# EasyEDA Pro project Chaoticvolt-4 digit 7seg display.eprj

# Schematic 4 digit 7seg display
Board Name: 4 digit 7seg display; Create Date: 2023-04-09; Page Name: display; Project Name: Chaoticvolt-4 digit 7seg display; Schematic Name: 4 digit 7seg display; Update Date: 2024-12-22; Company: Chaoticvolt; Drawed: Robin; Page Size: A4; Part Number: NTOCLOCKPCB-002; Reviewed: Robin; Version: V0.1
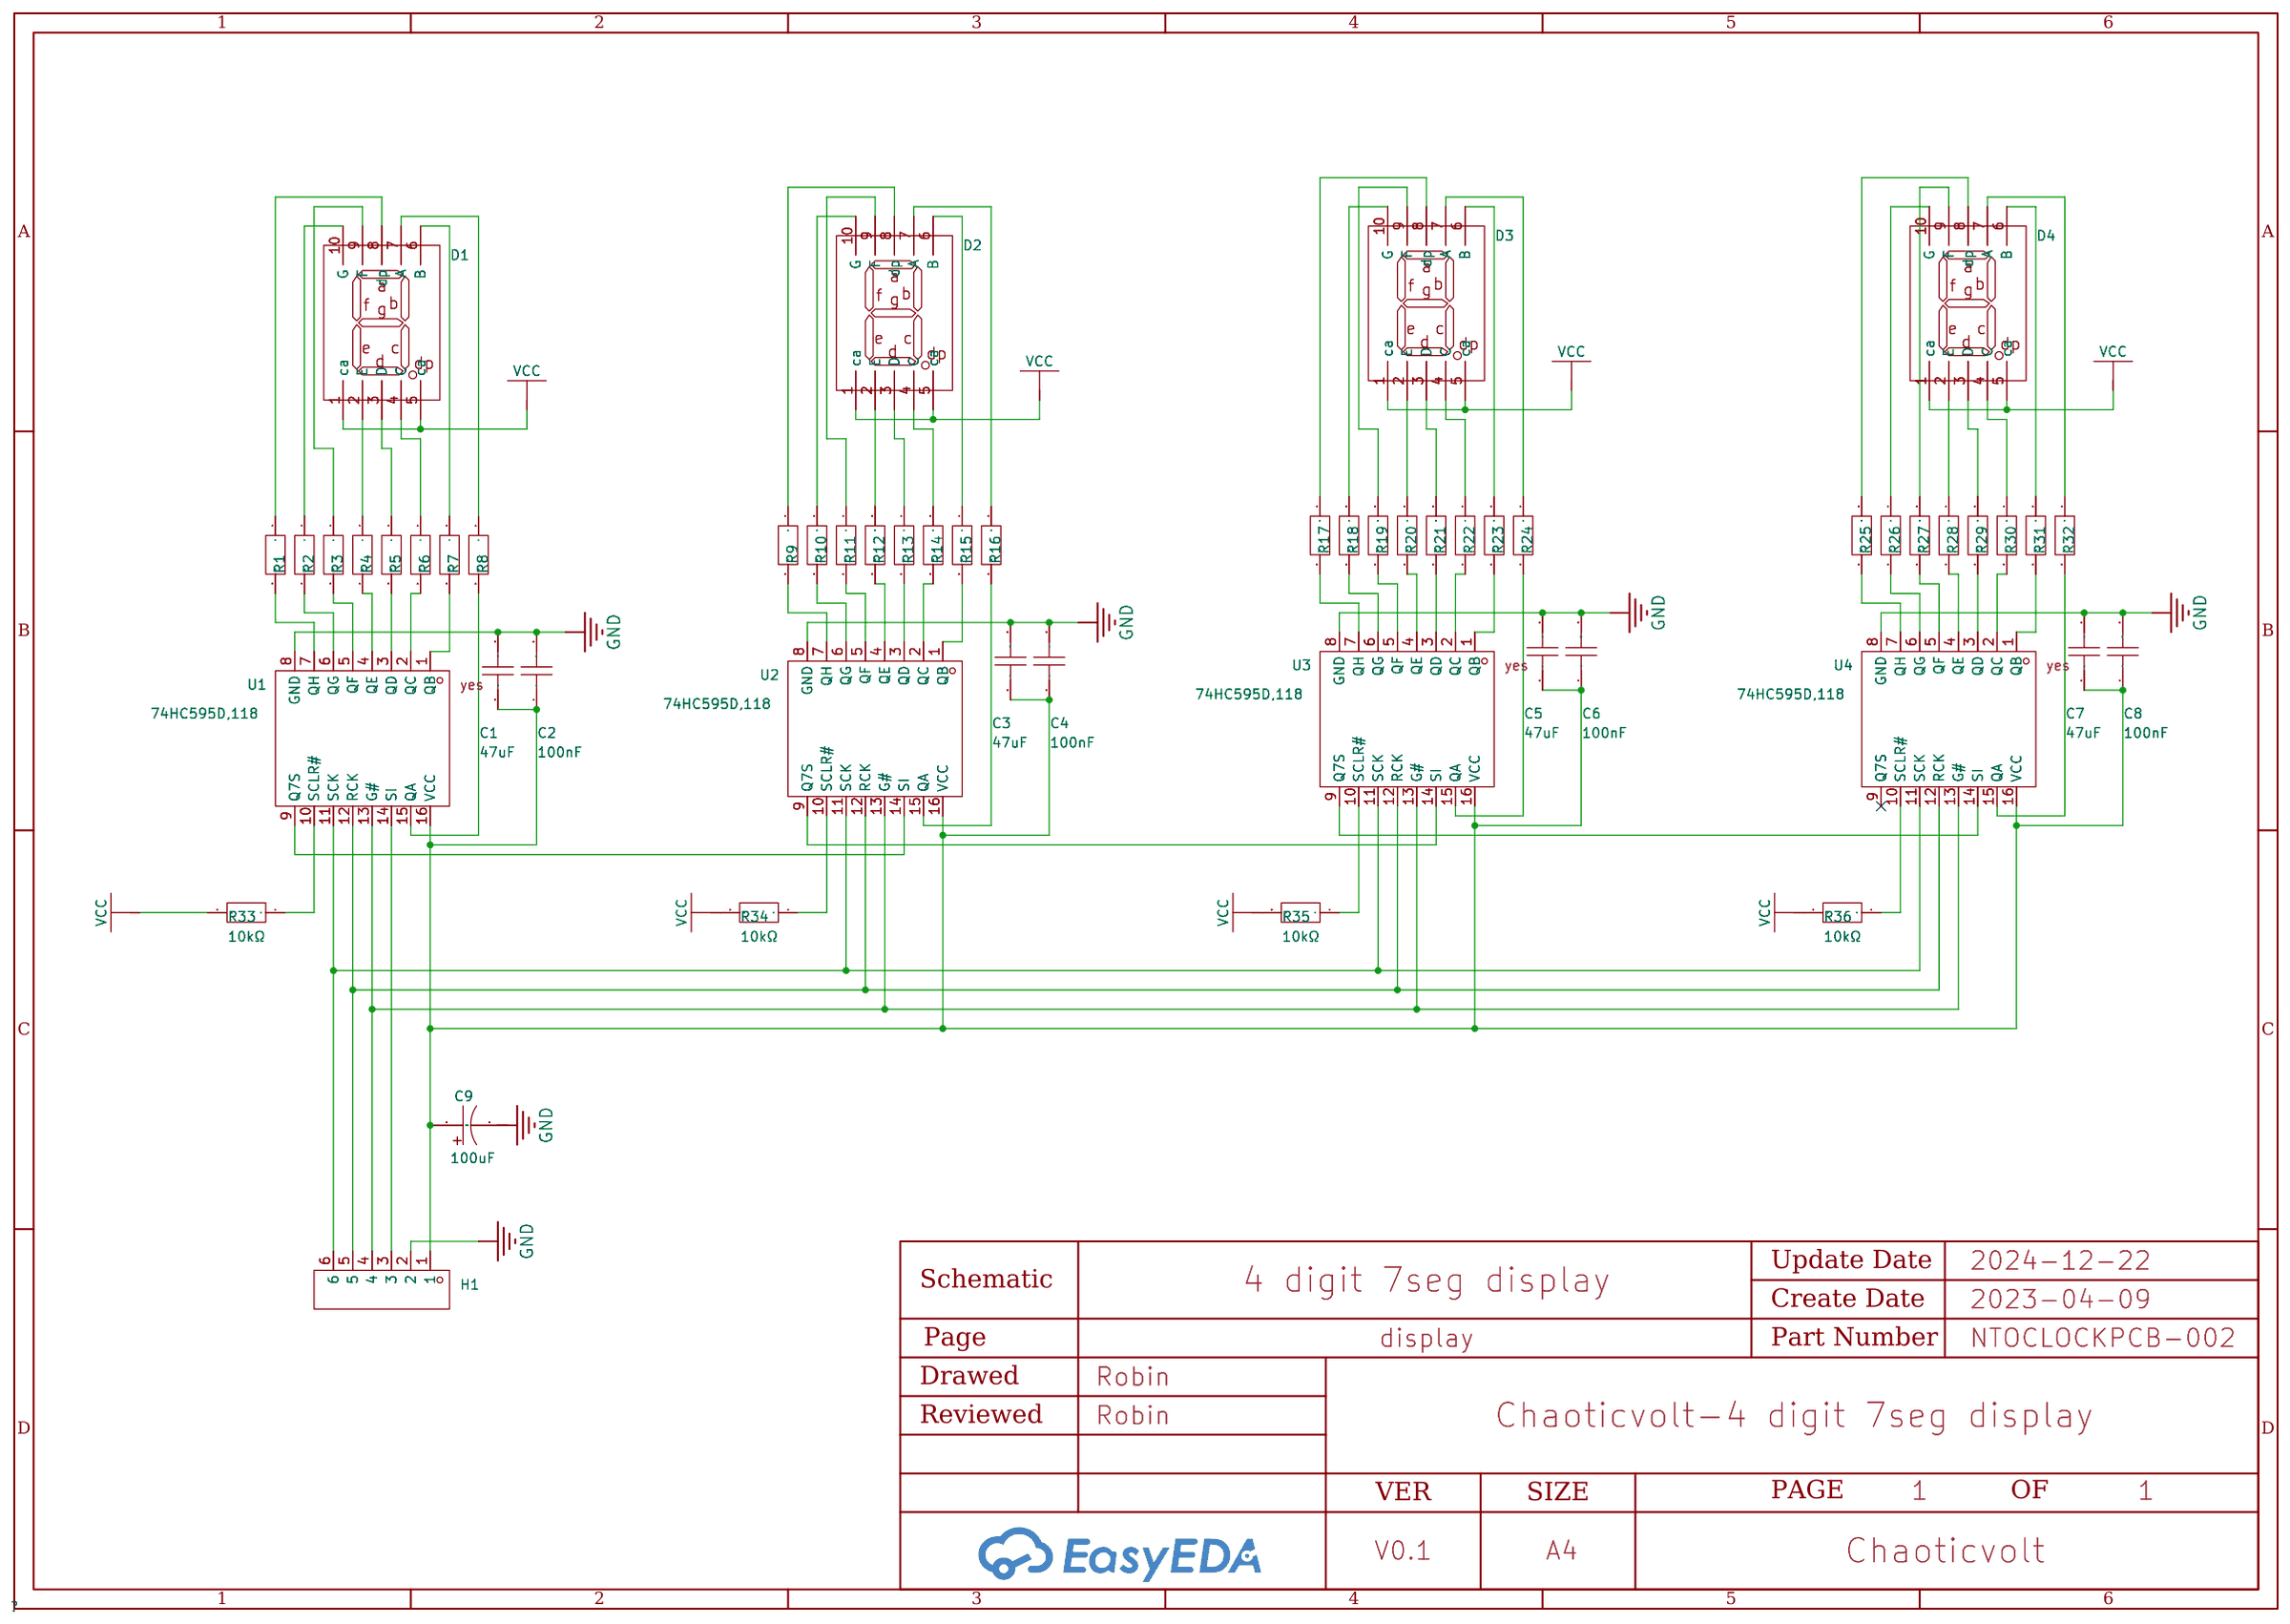
[diagram p0: schematic sheet]

## Parts
C1  47uF  [C1206]
C2  100nF  [C0402_NEW]
C3  47uF  [C1206]
C4  100nF  [C0402_NEW]
C5  47uF  [C1206]
C6  100nF  [C0402_NEW]
C7  47uF  [C1206]
C8  100nF  [C0402_NEW]
C9  100uF  [CAP-SMD_L3.5-W2.8-R-RD]
D1  -  [FJS12101]
D2  -  [FJS12101]
D3  -  [FJS12101]
D4  -  [FJS12101]
H1  -  [HDR-TH_6P-P2.54-V_Z-211-0611-0021-001]  (no BOM)
R1  100Ω  [R0805]
R2  100Ω  [R0805]
R3  100Ω  [R0805]
R4  100Ω  [R0805]
R5  100Ω  [R0805]
R6  100Ω  [R0805]
R7  100Ω  [R0805]
R8  100Ω  [R0805]
R9  100Ω  [R0805]
R10  100Ω  [R0805]
R11  100Ω  [R0805]
R12  100Ω  [R0805]
R13  100Ω  [R0805]
R14  100Ω  [R0805]
R15  100Ω  [R0805]
R16  100Ω  [R0805]
R17  100Ω  [R0805]
R18  100Ω  [R0805]
R19  100Ω  [R0805]
R20  100Ω  [R0805]
R21  100Ω  [R0805]
R22  100Ω  [R0805]
R23  100Ω  [R0805]
R24  100Ω  [R0805]
R25  100Ω  [R0805]
R26  100Ω  [R0805]
R27  100Ω  [R0805]
R28  100Ω  [R0805]
R29  100Ω  [R0805]
R30  100Ω  [R0805]
R31  100Ω  [R0805]
R32  100Ω  [R0805]
R33  10kΩ  [R0805]
R34  10kΩ  [R0805]
R35  10kΩ  [R0805]
R36  10kΩ  [R0805]
U1  74HC595D,118  [SOIC-16_L9.9-W3.9-P1.27-LS6.0-BL]
U2  74HC595D,118  [SOIC-16_L9.9-W3.9-P1.27-LS6.0-BL]
U3  74HC595D,118  [SOIC-16_L9.9-W3.9-P1.27-LS6.0-BL]
U4  74HC595D,118  [SOIC-16_L9.9-W3.9-P1.27-LS6.0-BL]

## Library data of the parts
C1 C3 C5 C7 = CL31A476MPHNNNE: Capacitance: Tolerance:±20% Tolerance:±20% Voltage Rated: Temperature Coefficient:; LCSC Part Name: 47uF ±20% 10V; Supplier Part: C96123; Manufacturer: SAMSUNG(三星); Supplier Footprint: 1206; JLCPCB Part Class: Basic Part; Datasheet: https://atta.szlcsc.com/upload/public/pdf/source/20170228/1488267692219.pdf; Supplier: LCSC; Tolerance: ±20%
C2 C4 C6 C8 = CL05B104KO5NNNC: Capacitance: Tolerance:±10% Tolerance:±10% Voltage Rated: Temperature Coefficient:; LCSC Part Name: 100nF ±10% 16V; Supplier Part: C1525; Manufacturer: SAMSUNG(三星); Supplier Footprint: 0402; JLCPCB Part Class: Basic Part; Datasheet: https://atta.szlcsc.com/upload/public/pdf/source/20160103/1457707674891.pdf; Supplier: LCSC; Tolerance: ±10%
C9 = CA45-B-10V-100uF-M: Capacitance: Tolerance:±20% Tolerance:±20% Rated Voltage: Equivalent Series Resistance(ESR):4Ω@100kHz Operating Temperature:-55℃~+125℃ Operating Temperature:-55℃~+125℃; LCSC Part Name: 100uF ±20% 10V; Supplier Part: C140381; Manufacturer: CEC(振华新云); Supplier Footprint: CASE-B-3528; JLCPCB Part Class: Extended Part; Datasheet: https://atta.szlcsc.com/upload/public/pdf/source/20171113/C140381_15105612817941115748.pdf; Supplier: LCSC; Tolerance: ±20%; Equivalent Series Resistance(ESR): 4Ω@100kHz; Operating Temperature: -55℃~+125℃
D1-D4 = FJS12101
H1 = PZ254R-11-06P: Pitch:2.54mm Number of Pins:6 Number of Rows: Pin Structure:1x6P Row Spacing:- Mounting Type:Shrouded Circluar Pins/Square Pins:Square Pins Current Rating (Max):- Voltage Rating (Max):- Length of Mating Pin:6mm Insulation Height:2.5mm Contact Material: Contact Plating:- Operating Temperature Range:-40~+105 Operating Temperature Range:-40~+105 Color:Black; LCSC Part Name: 2.54mm 1x6P 弯插 方针; Supplier Part: C492414; Manufacturer: XFCN(兴飞); Supplier Footprint: 弯插,P=2.54mm; JLCPCB Part Class: Extended Part; Datasheet: https://atta.szlcsc.com/upload/public/pdf/source/20200309/C492414_188252315A8FC19F8382BF484DD4F4B8.pdf; Supplier: LCSC; Pitch: 2.54mm; Number of Pins: 6; Pin Structure: 1x6P; Mounting Type: Shrouded; Circluar Pins/Square Pins: Square Pins; Length of Mating Pin: 6mm; Insulation Height: 2.5mm; Operating Temperature Range: -40~+105; Color: Black
R1-R32 = 0805W8F1000T5E_C17408: Type:Thick Film Resistors Resistance: Tolerance:±1% Tolerance:±1% Power(Watts): Temperature Coefficient:±100ppm/℃ Temperature Coefficient:±100ppm/℃ Overload Voltage (Max): Operating Temperature Range:-55℃~+155℃ Operating Temperature Range:-55℃~+155℃; LCSC Part Name: 100Ω ±1% 125mW; Supplier Part: C17408; Manufacturer: UNI-ROYAL(厚声); Manufacturer Part: 0805W8F1000T5E; Supplier Footprint: 0805; JLCPCB Part Class: Basic Part; Datasheet: https://atta.szlcsc.com/upload/public/pdf/source/20200306/C422600_1E6D84923E4A46A82E41ADD87F860B5C.pdf; Supplier: LCSC; Type: Thick Film Resistors; Tolerance: ±1%; Temperature Coefficient: ±100ppm/℃; Operating Temperature Range: -55℃~+155℃
R33-R36 = 0805W8F1002T5E: Type:Thick Film Resistors Resistance: Tolerance:±1% Tolerance:±1% Power(Watts): Temperature Coefficient:±100ppm/℃ Temperature Coefficient:±100ppm/℃ Overload Voltage (Max): Operating Temperature Range:-55℃~+155℃ Operating Temperature Range:-55℃~+155℃; LCSC Part Name: 10kΩ ±1% 125mW; Supplier Part: C17414; Manufacturer: UNI-ROYAL(厚声); Supplier Footprint: 0805; JLCPCB Part Class: Basic Part; Datasheet: https://atta.szlcsc.com/upload/public/pdf/source/20200306/C422600_1E6D84923E4A46A82E41ADD87F860B5C.pdf; Supplier: LCSC; Type: Thick Film Resistors; Tolerance: ±1%; Temperature Coefficient: ±100ppm/℃; Operating Temperature Range: -55℃~+155℃
U1-U4 = 74HC595D,118: Series: Logic Type:ShiftRegister Output Type:Tri-State Function:Serial to parallel, serial Voltage - Supply:2V~6V Voltage - Supply:2V~6V Operating Temperature:-40℃~+125℃ Operating Temperature:-40℃~+125℃; Supplier Part: C5947; Manufacturer: Nexperia(安世); Supplier Footprint: SOIC-16-150mil; JLCPCB Part Class: Basic Part; Datasheet: https://atta.szlcsc.com/upload/public/pdf/source/20140108/1457706668762.pdf; Supplier: LCSC; Logic Type: ShiftRegister; Output Type: Tri-State; Function: Serial to parallel, serial; Voltage - Supply: 2V~6V; Operating Temperature: -40℃~+125℃

## Nets
GND: C1.2 C2.2 C3.2 C4.2 C5.2 C6.2 C7.2 C8.2 C9.2 H1.2 U1.8(GND) U2.8(GND) U3.8(GND) U4.8(GND)
VCC: D1.1(ca) D1.5(ca) D2.1(ca) D2.5(ca) D3.1(ca) D3.5(ca) D4.1(ca) D4.5(ca) R33.2 R34.2 R35.2 R36.2
$1N2297: U1.9(Q7S) U2.14(SI)
$1N2299: R8.2 U1.15(QA)
$1N2301: R33.1 U1.10(SCLR#)
$1N2302: H1.4 U1.13(G#) U2.13(G#) U3.13(G#) U4.13(G#)
$1N2303: H1.5 U1.12(RCK) U2.12(RCK) U3.12(RCK) U4.12(RCK)
$1N2304: H1.3 U1.14(SI)
$1N2305: H1.6 U1.11(SCK) U2.11(SCK) U3.11(SCK) U4.11(SCK)
$1N6011: R7.2 U1.1(QB)
$1N6089: R3.2 U1.5(QF)
$1N6122: R6.2 U1.2(QC)
$1N6177: R5.2 U1.3(QD)
$1N6264: R4.2 U1.4(QE)
$1N6486: R2.2 U1.6(QG)
$1N6506: R1.2 U1.7(QH)
$1N40619: D1.7(A) R8.1
$1N40652: D1.6(B) R7.1
$1N40781: D1.9(F) R3.1
$1N41012: D1.10(G) R2.1
$1N41044: D1.8(dp) R1.1
$1N41338: D1.2(E) R4.1
$1N41427: D1.4(C) R6.1
$1N41428: D1.3(D) R5.1
$1N45593: R9.2 U2.7(QH)
$1N45594: R12.2 U2.4(QE)
$1N45595: R14.2 U2.2(QC)
$1N45596: R15.2 U2.1(QB)
$1N45597: R10.2 U2.6(QG)
$1N45598: R13.2 U2.3(QD)
$1N45599: R11.2 U2.5(QF)
$1N45600: R16.2 U2.15(QA)
$1N45601: D2.7(A) R16.1
$1N45602: D2.6(B) R15.1
$1N45603: D2.9(F) R11.1
$1N45604: D2.10(G) R10.1
$1N45605: D2.8(dp) R9.1
$1N45606: D2.4(C) R14.1
$1N45607: D2.3(D) R13.1
$1N45609: D2.2(E) R12.1
$1N46574: R17.2 U3.7(QH)
$1N46575: R20.2 U3.4(QE)
$1N46576: R22.2 U3.2(QC)
$1N46577: R23.2 U3.1(QB)
$1N46578: R18.2 U3.6(QG)
$1N46579: R21.2 U3.3(QD)
$1N46580: R19.2 U3.5(QF)
$1N46581: R24.2 U3.15(QA)
$1N46582: D3.7(A) R24.1
$1N46583: D3.6(B) R23.1
$1N46584: D3.9(F) R19.1
$1N46585: D3.10(G) R18.1
$1N46586: D3.8(dp) R17.1
$1N46587: D3.4(C) R22.1
$1N46588: D3.3(D) R21.1
$1N46590: D3.2(E) R20.1
$1N47559: R25.2 U4.7(QH)
$1N47560: R28.2 U4.4(QE)
$1N47561: R30.2 U4.2(QC)
$1N47562: R31.2 U4.1(QB)
$1N47563: R26.2 U4.6(QG)
$1N47564: R29.2 U4.3(QD)
$1N47565: R27.2 U4.5(QF)
$1N47566: R32.2 U4.15(QA)
$1N47567: D4.7(A) R32.1
$1N47568: D4.6(B) R31.1
$1N47569: D4.9(F) R27.1
$1N47570: D4.10(G) R26.1
$1N47571: D4.8(dp) R25.1
$1N47572: D4.4(C) R30.1
$1N47573: D4.3(D) R29.1
$1N47575: D4.2(E) R28.1
$1N47985: U2.9(Q7S) U3.14(SI)
$1N48013: U3.9(Q7S) U4.14(SI)
$1N52982: R34.1 U2.10(SCLR#)
$1N53020: R36.1 U4.10(SCLR#)
$1N56731: C1.1 C2.1 C3.1 C4.1 C5.1 C6.1 C7.1 C8.1 C9.1 H1.1 U1.16(VCC) U2.16(VCC) U3.16(VCC) U4.16(VCC)
$1N57025: R35.1 U3.10(SCLR#)

Not connected (* = marked no-connect by the designer): U4 9(Q7S)*

# Board display
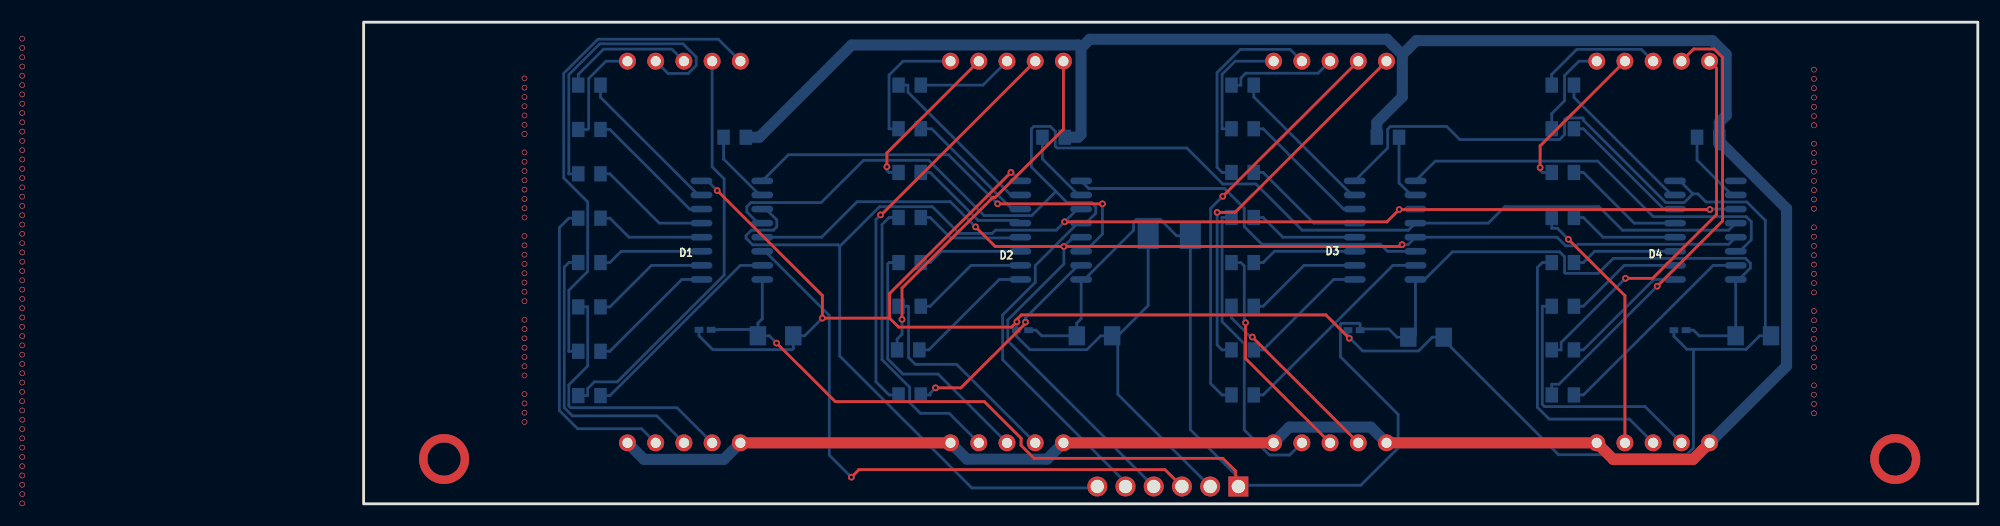
[diagram p1: board, top side]
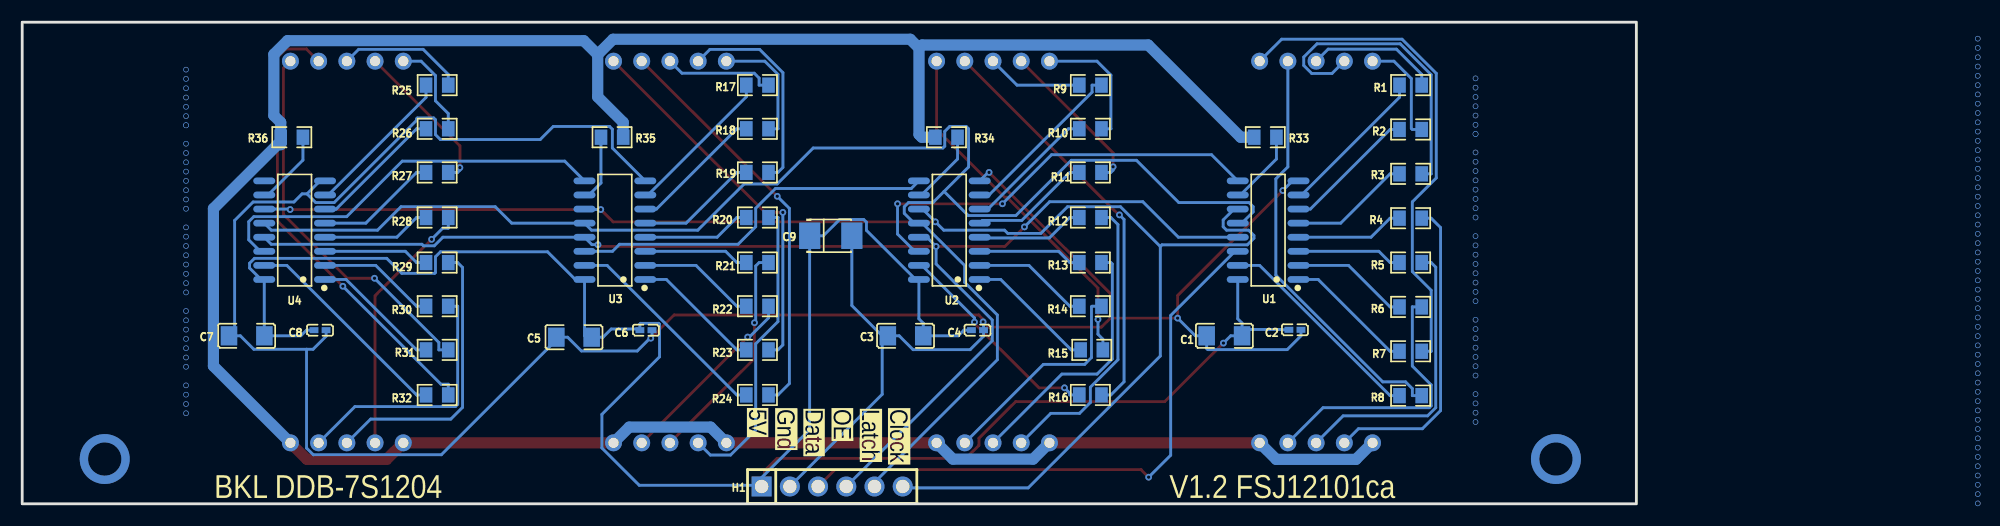
[diagram p2: board, bottom side, seen from below]

Outline 145.3 x 43.43 mm; copper layers: Top Layer, Bottom Layer. Coordinates in mm from the lower left corner of the outline.
Outline path: rectangle 0,43.43 145.3,0
Stack: Top Layer 0.035mm / Dielectric1 1.51mm FR4 er 4.5 / Bottom Layer 0.035mm

## Design rules (mm)
spacing safeClearance (default): track to track 0.152, other pairs 0.152 to 0.3
track width trackWidth (default): min 0.127, default 0.254, max 2.54
track width Vcc: min 0.6, default 1, max 2.54
differential pair differentialPair (default): width min 0.127, default 0.254, max 2.54; gap min 0.152, default 0.152
via viaSize (default): diameter min 0.5, default 0.61, max 10; hole min 0.3, default 0.305, max 6
net VCC uses Vcc

## Placement (name value [footprint] x y rotation side)
C1  47uF  [C1206]  37.08 15.15 0 bottom
C2  100nF  [C0402_NEW]  30.73 15.69 180 bottom
C3  47uF  [C1206]  65.79 15.15 0 bottom
C4  100nF  [C0402_NEW]  59.31 15.66 180 bottom
C5  47uF  [C1206]  95.63 15.02 0 bottom
C6  100nF  [C0402_NEW]  89.15 15.66 180 bottom
C7  47uF  [C1206]  125.1 15.15 0 bottom
C8  100nF  [C0402_NEW]  118.49 15.66 180 bottom
C9  100uF  [CAP-SMD_L3.5-W2.8-R-RD]  72.52 24.17 0 bottom
D1  -  [FJS12101]  28.83 22.77 0 top
D2  -  [FJS12101]  57.91 22.77 0 top
D3  -  [FJS12101]  87 22.77 0 top
D4  -  [FJS12101]  116.08 22.77 0 top
H1  -  [HDR-TH_6P-P2.54-V_Z-211-0611-0021-001]  72.39 1.56 180 bottom
R1  100Ω  [R0805]  20.32 37.76 0 bottom
R2  100Ω  [R0805]  20.32 33.76 0 bottom
R3  100Ω  [R0805]  20.32 29.76 0 bottom
R4  100Ω  [R0805]  20.32 25.76 0 bottom
R5  100Ω  [R0805]  20.32 21.76 0 bottom
R6  100Ω  [R0805]  20.32 17.76 0 bottom
R7  100Ω  [R0805]  20.32 13.76 0 bottom
R8  100Ω  [R0805]  20.32 9.76 0 bottom
R9  100Ω  [R0805]  49.15 37.76 180 bottom
R10  100Ω  [R0805]  49.15 33.82 0 bottom
R11  100Ω  [R0805]  49.15 29.88 0 bottom
R12  100Ω  [R0805]  49.15 25.82 0 bottom
R13  100Ω  [R0805]  49.15 21.76 0 bottom
R14  100Ω  [R0805]  49.15 17.82 0 bottom
R15  100Ω  [R0805]  49.02 13.88 0 bottom
R16  100Ω  [R0805]  49.15 9.82 0 bottom
R17  100Ω  [R0805]  79.12 37.76 0 bottom
R18  100Ω  [R0805]  79.12 33.82 0 bottom
R19  100Ω  [R0805]  79.12 29.88 0 bottom
R20  100Ω  [R0805]  79.12 25.82 0 bottom
R21  100Ω  [R0805]  79.12 21.76 0 bottom
R22  100Ω  [R0805]  79.12 17.82 0 bottom
R23  100Ω  [R0805]  79.12 13.88 0 bottom
R24  100Ω  [R0805]  79.12 9.82 0 bottom
R25  100Ω  [R0805]  107.95 37.76 0 bottom
R26  100Ω  [R0805]  107.95 33.82 0 bottom
R27  100Ω  [R0805]  107.95 29.88 0 bottom
R28  100Ω  [R0805]  107.95 25.82 0 bottom
R29  100Ω  [R0805]  107.95 21.76 0 bottom
R30  100Ω  [R0805]  107.95 17.82 0 bottom
R31  100Ω  [R0805]  107.95 13.88 0 bottom
R32  100Ω  [R0805]  107.95 9.82 0 bottom
R33  10kΩ  [R0805]  33.4 33.06 0 bottom
R34  10kΩ  [R0805]  62.1 33.06 0 bottom
R35  10kΩ  [R0805]  92.2 33.06 180 bottom
R36  10kΩ  [R0805]  121.03 33.06 0 bottom
U1  74HC595D,118  [SOIC-16_L9.9-W3.9-P1.27-LS6.0-BL]  33.15 24.68 90 bottom
U2  74HC595D,118  [SOIC-16_L9.9-W3.9-P1.27-LS6.0-BL]  61.85 24.68 90 bottom
U3  74HC595D,118  [SOIC-16_L9.9-W3.9-P1.27-LS6.0-BL]  91.95 24.68 90 bottom
U4  74HC595D,118  [SOIC-16_L9.9-W3.9-P1.27-LS6.0-BL]  120.78 24.68 90 bottom

## Footprints (pads in the part's own frame, mm; a bottom-side part is the same pattern mirrored in y, then rotated)
C0402_NEW
  rect 0.79x0.54 smd: 1(-0.545,0) 2(0.545,0)
C1206
  rect 1.485x1.728 smd: 1(-1.593,0) 2(1.593,0)
CAP-SMD_L3.5-W2.8-R-RD
  rect 1.9x2.376 smd: 1(1.899,0) 2(-1.899,0)
FJS12101
  round 1.524 hole 0.914: 1(-5.08,-17.272) 2(-2.54,-17.272) 3(0,-17.272) 4(2.54,-17.272) 5(5.08,-17.272) 6(5.08,17.145) 7(2.54,17.145) 8(0,17.145) 9(-2.54,17.145) 10(-5.08,17.145)
HDR-TH_6P-P2.54-V_Z-211-0611-0021-001
  rect 1.801x1.801 hole 1.199: 1(-6.35,0)
  round 1.801 hole 1.199: 2(-3.81,0) 3(-1.27,0) 4(1.27,0) 5(3.81,0) 6(6.35,0)
R0805
  rect 1.133x1.377 smd: 1(-1,0) 2(1,0)
SOIC-16_L9.9-W3.9-P1.27-LS6.0-BL
  oval 0.602x1.971 smd: 1(-4.445,-2.736) 2(-3.175,-2.736) 3(-1.905,-2.736) 4(-0.635,-2.736) 5(0.635,-2.736) 6(1.905,-2.736) 7(3.175,-2.736) 8(4.445,-2.736) 9(4.445,2.736) 10(3.175,2.736) 11(1.905,2.736) 12(0.635,2.736) 13(-0.635,2.736) 14(-1.905,2.736) 15(-3.175,2.736) 16(-4.445,2.736)

## Nets
As in the schematic.

Pads without a net: U4 9

## Via types
v1: diameter 0.5, hole 0.4, Top Layer to Bottom Layer, 121 vias
v2: diameter 0.61, hole 0.305, Top Layer to Bottom Layer, 28 vias
v3: diameter 4.5, hole 3, Top Layer to Bottom Layer, 2 vias

## Routing (per net, layer and track width the routed paths; a pad name or vN(x,y) marks a point on that pad's centre or on a via; arc(x,y) is an arc through that point)
GND: length 253.9
  Top Layer w0.254: v2(31.83,28.25) 41.29,18.78 v2(41.29,16.74) 47.34,16.74 ; 47.34,16.74 48.16,15.93 58.33,15.93 v2(58.8,16.41) 58.8,16.64 59.2,17.04 86.61,17.04 v2(88.72,14.93) ; 47.34,16.74 47.34,18.96 v2(58.27,29.89)
  Bottom Layer w0.254: 119.66,27.95 118.49,29.12 U4.8 ; 119.66,27.95 120.11,27.95 120.84,27.22 124.52,27.22 126.18,25.56 126.18,15.15 ; 119.66,27.95 118.88,27.17 117.22,27.17 109.8,34.58 109.8,34.72 109.73,34.8 108.26,34.8 108.1,34.64 108.1,33.29 107.66,32.85 98.67,32.85 97.5,34.03 92.43,34.03 92.18,33.78 92.18,32.09 U3.8 ; C5.2 96.97,15.02 ; 96.97,15.02 96.2,15.02 94.96,13.78 89.94,13.78 88.75,14.97 ; 96.97,15.02 107.57,4.43 119.1,4.43 119.7,5.03 119.7,13.94 ; H1.2 67.89,9.87 67.89,15.15 ; v2(31.83,28.25) 30.95,29.12 U1.8 ; 30.19,15.7 30.19,15.15 31.43,13.91 38.58,13.91 38.68,14.01 C1.2 39.7,15.15 v2(41.29,16.74) ; C7.2 126.18,15.15 ; 126.18,15.15 125.67,15.15 124.45,13.94 119.7,13.94 ; C6.2 88.61,15.11 88.75,14.97 ; 67.89,15.15 70.62,17.88 C9.2 ; 67.89,15.15 C3.2 66.36,15.15 65.11,13.9 59.97,13.9 58.76,15.11 58.76,16.37 v2(58.8,16.41) ; 88.75,14.97 v2(88.72,14.93) ; 119.7,13.94 119.12,13.94 117.95,15.11 C8.2 ; U2.8 58.35,29.89 v2(58.27,29.89)
  vias: v1(14.48,38.37) v1(14.48,37.53) v1(14.48,36.69) v1(14.48,35.85) v1(14.48,35.02) v1(14.48,34.18) v1(14.48,33.36) v1(14.48,33.34) v1(14.48,31.69) v1(14.48,30.85) v1(14.48,30.01) v1(14.48,29.17) v1(14.48,28.33) v1(14.48,27.5) v1(14.48,26.66) v1(14.48,25.82) v1(14.48,24.14) v1(14.48,23.31) v1(14.48,22.47) v1(14.48,21.63) v1(14.48,20.79) v1(14.48,19.95) v1(14.48,19.11) v1(14.48,18.28) v1(14.48,16.6) v1(14.48,15.76) v1(14.48,14.92) v1(14.48,14.08) v1(14.48,13.25) v1(14.48,12.41) v1(14.48,11.57) v1(14.48,9.89) v1(14.48,9.06) v1(14.48,8.22) v1(14.48,7.38) v1(130.56,39.16) v1(130.56,38.32) v1(130.56,37.48) v1(130.56,36.64) v1(130.56,35.8) v1(130.56,34.96) v1(130.56,34.15) v1(130.56,34.13) v1(130.56,32.47) v1(130.56,31.64) v1(130.56,30.8) v1(130.56,29.96) v1(130.56,29.12) v1(130.56,28.28) v1(130.56,27.45) v1(130.56,26.61) v1(130.56,24.93) v1(130.56,24.09) v1(130.56,23.25) v1(130.56,22.42) v1(130.56,21.58) v1(130.56,20.74) v1(130.56,19.9) v1(130.56,19.06) v1(130.56,17.39) v1(130.56,16.55) v1(130.56,15.71) v1(130.56,14.87) v1(130.56,14.03) v1(130.56,13.2) v1(130.56,12.36) v1(130.56,10.68) v1(130.56,9.84) v1(130.56,9) v1(130.56,8.17) v3(7.24,4.04) v3(137.87,4.04)
VCC: length 254.6
  Top Layer w1.001: D3.1 D2.5 ; 52.83,5.5 D1.5 ; 121.16,5.5 119.67,4.01 112.49,4.01 D4.1 D3.5
  Bottom Layer w1.001: 121.16,5.5 128.09,12.43 128.09,26.62 122.32,32.39 122.03,32.39 122.03,34.4 122.65,35.02 122.65,40.53 121.42,41.77 94.75,41.77 93.5,40.51 ; D2.5 61.52,4.03 54.3,4.03 52.83,5.5 ; 93.5,40.51 93.5,36.7 91.2,34.4 R35.2 ; 93.5,40.51 92.12,41.89 65.36,41.89 64.57,41.1 ; R33.2 35.62,33.06 43.94,41.38 64.29,41.38 64.57,41.1 ; 64.57,41.1 64.57,33.31 64.32,33.06 63.1,33.06 ; D3.5 90.66,6.92 83.33,6.92 D3.1 ; D1.1 25.24,4.01 32.42,4.01 D1.5
(no net):
  vias: v1(-30.73,41.95) v1(-30.73,41.11) v1(-30.73,40.27) v1(-30.73,39.43) v1(-30.73,38.6) v1(-30.73,37.76) v1(-30.73,36.92) v1(-30.73,36.08) v1(-30.73,35.24) v1(-30.73,34.41) v1(-30.73,33.57) v1(-30.73,32.73) v1(-30.73,31.89) v1(-30.73,31.05) v1(-30.73,30.21) v1(-30.73,29.38) v1(-30.73,28.54) v1(-30.73,27.7) v1(-30.73,26.86) v1(-30.73,26.02) v1(-30.73,25.18) v1(-30.73,24.35) v1(-30.73,23.51) v1(-30.73,22.67) v1(-30.73,21.83) v1(-30.73,20.99) v1(-30.73,20.16) v1(-30.73,19.32) v1(-30.73,18.48) v1(-30.73,17.64) v1(-30.73,16.8) v1(-30.73,15.96) v1(-30.73,15.13) v1(-30.73,14.29) v1(-30.73,13.45) v1(-30.73,12.61) v1(-30.73,11.77) v1(-30.73,10.94) v1(-30.73,10.1) v1(-30.73,9.26) v1(-30.73,8.42) v1(-30.73,7.58) v1(-30.73,6.74) v1(-30.73,5.91) v1(-30.73,5.07) v1(-30.73,4.23) v1(-30.73,3.39) v1(-30.73,2.55) v1(-30.73,1.72) v1(-30.73,0.88) v1(-30.73,0.04)
$1N2297: length 38.7
  Top Layer w0.254: v2(57.07,27.06) v2(66.51,27.06)
  Bottom Layer w0.254: U2.14 64.95,22.77 66.51,24.33 v2(66.51,27.06) ; v2(57.07,27.06) 52.64,31.48 38.24,31.48 U1.9
$1N2299: length 19.4
  Bottom Layer w0.254: 21.32,9.76 22.17,9.76 33.91,21.5 U1.15
$1N2301: length 6.8
  Bottom Layer w0.254: R33.1 32.4,31.1 35.64,27.85 U1.10
$1N2302: length 122.7
  Top Layer w0.254: v2(55.08,24.97) 56.85,23.21 v2(63.04,23.21) 93.32,23.21 v2(93.47,23.37)
  Bottom Layer w0.254: U4.13 122.88,23.41 109.32,23.41 109.18,23.27 108.21,23.27 107.43,24.04 U3.13 94.01,23.37 v2(93.47,23.37) ; U1.13 41.23,24.04 44.42,27.24 52.82,27.24 v2(55.08,24.97) ; U2.13 63.87,24.04 v2(63.04,23.21) 63.04,21.63 57.98,16.58 57.98,14.7 H1.4
$1N2303: length 149.4
  Bottom Layer w0.254: U1.12 35.51,25.31 34.5,26.32 34.5,26.79 34.87,27.17 41.19,27.17 45,30.98 50.87,30.98 55.85,26 60.14,26 62.32,28.17 ; 62.32,28.17 60.11,30.38 60.11,33.81 60.33,34.03 61.81,34.03 62.26,33.59 62.26,32.25 62.42,32.09 74.09,32.09 77.34,28.84 80.32,28.84 84.49,24.68 94.05,24.68 U3.12 101.24,25.31 102.72,26.79 111.2,26.79 113.32,24.68 122.88,24.68 U4.12 ; 62.32,28.17 63.32,27.17 65.52,27.17 65.9,26.78 65.9,26.2 65.01,25.31 U2.12 64.28,25.31 60.46,21.49 60.46,19.97 57.52,17.03 57.52,12.99 68.58,1.93 H1.5
$1N2304: length 54.8
  Top Layer w0.254: v2(43.9,2.4) 44.59,3.09 72.14,3.09 H1.3 73.66,1.31
  Bottom Layer w0.254: v2(43.9,2.4) 41.92,4.38 41.92,16.99 36.13,22.77 U1.14
$1N2305: length 139.6
  Top Layer w0.254: v2(63.1,25.43) 92.11,25.43 v2(93.22,26.54) v2(121.18,26.54)
  Bottom Layer w0.254: 65.79,1.44 54.74,1.44 42.86,13.33 42.86,23.21 ; U3.11 94.64,26.54 v2(93.22,26.54) ; 42.86,23.21 42.7,23.36 35.02,23.36 34.42,23.95 34.42,24.19 34.9,24.68 36.89,24.68 37.19,24.98 37.19,25.6 36.21,26.58 U1.11 ; 42.86,23.21 46.44,26.79 51.2,26.79 53.61,24.38 56.58,24.38 56.87,24.68 62.35,24.68 v2(63.1,25.43) 64.25,26.58 U2.11 ; U4.11 121.22,26.58 v2(121.18,26.54)
$1N6011: length 11.8
  Bottom Layer w0.254: R7.2 22.17,13.76 28.64,20.23 U1.1
$1N6089: length 10.9
  Bottom Layer w0.254: 21.32,29.76 22.17,29.76 26.61,25.31 U1.5
$1N6122: length 10.6
  Bottom Layer w0.254: U1.2 25.91,21.5 22.17,17.76 R6.2
$1N6177: length 9.5
  Bottom Layer w0.254: U1.3 23.18,22.77 22.17,21.76 R5.2
$1N6264: length 9.8
  Bottom Layer w0.254: 21.32,25.76 22.17,25.76 23.88,24.04 U1.4
$1N6486: length 12.1
  Bottom Layer w0.254: R2.2 22.17,33.76 29.34,26.58 U1.6
$1N6506: length 13.8
  Bottom Layer w0.254: R1.2 21.32,36.66 30.13,27.85 U1.7
$1N40619: length 37.7
  Bottom Layer w0.254: D1.7 31.37,30.38 32.45,29.3 32.45,20.62 22.83,11 20.77,11 20.17,10.39 20.17,9.76 19.32,9.76
$1N40652: length 45.5
  Bottom Layer w0.254: D1.6 31.93,41.9 21.09,41.9 18.01,38.82 18.01,29.38 20.17,27.23 20.17,20.95 18.47,19.26 18.47,13.76 18.47,13.76 19.32,13.76
$1N40781: length 28.1
  Bottom Layer w0.254: 19.32,29.76 18.47,29.76 18.47,29.76 18.47,38.7 21.26,41.48 28.75,41.48 29.94,40.29 29.94,39.53 29.22,38.81 27.4,38.81 D1.9
$1N41012: length 9.6
  Bottom Layer w0.254: D1.10 21.82,39.92 20.26,38.35 20.26,33.85 20.17,33.76 19.32,33.76
$1N41044: length 11.9
  Bottom Layer w0.254: 19.32,37.76 19.32,38.73 21.59,41 27.74,41 D1.8
$1N41338: length 28.4
  Bottom Layer w0.254: 19.32,25.76 18.47,25.76 17.62,24.91 17.62,8.41 19.26,6.77 25.02,6.77 D1.2
$1N41427: length 24.8
  Bottom Layer w0.254: D1.4 28.2,8.67 18.64,8.67 18.47,8.83 18.47,10.73 20.17,12.43 20.17,17.76 20.17,17.76 19.32,17.76
$1N41428: length 26.2
  Bottom Layer w0.254: 19.32,21.76 18.47,21.76 18.06,21.34 18.06,8.67 18.79,7.93 26.4,7.93 D1.3
$1N45593: length 15.4
  Bottom Layer w0.254: R9.2 48.99,37.76 48.99,37.12 58.27,27.85 U2.7
$1N45594: length 9.8
  Bottom Layer w0.254: U2.4 59.05,23.97 52.84,23.97 51,25.82 R12.2
$1N45595: length 10.5
  Bottom Layer w0.254: U2.2 54.68,21.5 51,17.82 R14.2
$1N45596: length 11.7
  Bottom Layer w0.254: U2.1 57.22,20.23 50.87,13.88 50.02,13.88
$1N45597: length 12
  Bottom Layer w0.254: R10.2 51.13,33.82 58.37,26.58 U2.6
$1N45598: length 9.4
  Bottom Layer w0.254: R13.2 51,21.76 52.01,22.77 U2.3
$1N45599: length 10.9
  Bottom Layer w0.254: U2.5 58.87,25.56 55.32,25.56 51,29.88 R11.2
$1N45600: length 19.7
  Top Layer w0.254: v2(51.48,10.46) 53.77,10.46 59.58,16.27 v2(59.58,16.39)
  Bottom Layer w0.254: v2(59.58,16.39) 59.58,16.77 64.31,21.5 U2.15 ; R16.2 51,9.82 51,9.98 v2(51.48,10.46)
$1N45601: length 37.4
  Top Layer w0.254: v2(46.53,26.06) 46.59,26.06 60.45,39.92
  Bottom Layer w0.254: R16.1 47.3,9.82 46.12,11 46.12,25.64 v2(46.53,26.06)
$1N45602: length 32.4
  Top Layer w0.254: v2(48.46,16.63) 48.46,19.45 56.65,27.64 56.86,27.64 62.99,33.77 D2.6
  Bottom Layer w0.254: R15.1 48.02,14.85 48.46,15.29 v2(48.46,16.63)
$1N45603: length 14.4
  Top Layer w0.254: v2(47.1,30.39) 47.1,31.65 D2.9
  Bottom Layer w0.254: v2(47.1,30.39) 47.1,30.08 47.3,29.88 R11.1
$1N45604: length 11.7
  Bottom Layer w0.254: R10.1 47.3,33.82 47.3,33.82 47.3,38.66 48.55,39.92 52.83,39.92
$1N45605: length 8.7
  Bottom Layer w0.254: R9.1 55.75,37.76 D2.8
$1N45606: length 20.1
  Bottom Layer w0.254: 60.45,5.5 53.38,12.58 49.66,12.58 49.05,13.19 49.05,17.76 48.99,17.82 R14.1
$1N45607: length 23.5
  Bottom Layer w0.254: R13.1 47.3,21.76 47.17,21.63 47.17,13.07 48.54,11.7 51.71,11.7 D2.3
$1N45609: length 26.6
  Bottom Layer w0.254: R12.1 47.3,25.82 46.67,25.18 46.67,13 49.15,10.51 49.15,9.13 50.12,8.16 52.71,8.16 D2.2
$1N46574: length 13.8
  Bottom Layer w0.254: R17.2 80.12,36.7 88.97,27.85 U3.7
$1N46575: length 9.8
  Bottom Layer w0.254: U3.4 82.75,24.04 80.97,25.82 R20.2
$1N46576: length 10.6
  Bottom Layer w0.254: U3.2 84.65,21.5 80.97,17.82 R22.2
$1N46577: length 11.7
  Bottom Layer w0.254: R23.2 80.97,13.88 87.32,20.23 U3.1
$1N46578: length 12.1
  Bottom Layer w0.254: U3.6 88.21,26.58 80.97,33.82 R18.2
$1N46579: length 9.5
  Bottom Layer w0.254: R21.2 80.97,21.76 81.98,22.77 U3.3
$1N46580: length 11
  Bottom Layer w0.254: U3.5 85.54,25.31 80.97,29.88 R19.2
$1N46581: length 19.4
  Bottom Layer w0.254: R24.2 80.97,9.82 92.65,21.5 U3.15
$1N46582: length 36.9
  Top Layer w0.254: v2(77.34,27.73) 89.52,39.92 D3.7
  Bottom Layer w0.254: R24.1 77.27,9.82 76.24,10.85 76.24,26.64 v2(77.34,27.73)
$1N46583: length 34.3
  Top Layer w0.254: v2(76.83,26.28) 78.44,26.28 D3.6
  Bottom Layer w0.254: R23.1 77.27,13.88 76.83,14.33 v2(76.83,26.28)
$1N46584: length 19
  Bottom Layer w0.254: R19.1 77.27,29.88 76.82,30.34 76.82,38.88 78.92,40.98 83.39,40.98 D3.9
$1N46585: length 10.9
  Bottom Layer w0.254: R18.1 77.27,33.82 77.27,33.82 77.27,38.73 78.46,39.92 D3.10
$1N46586: length 10.1
  Bottom Layer w0.254: R17.1 78.97,37.76 78.97,38.39 79.41,38.83 85.91,38.83 D3.8
$1N46587: length 17.1
  Top Layer w0.254: D3.4 v2(80,15.04)
  Bottom Layer w0.254: R22.1 78.12,16.77 79.84,15.04 v2(80,15.04)
$1N46588: length 20.4
  Top Layer w0.254: D3.3 79.39,13.11 v2(79.39,16.33)
  Bottom Layer w0.254: v2(79.39,16.33) 79.27,16.44 79.27,21.45 78.97,21.76 R21.1
$1N46590: length 27.4
  Bottom Layer w0.254: R20.1 77.27,25.82 77.27,25.82 77.27,16.43 79.27,14.43 79.27,6.66 81.54,4.4 83.36,4.4 D3.2
$1N47559: length 13.8
  Bottom Layer w0.254: U4.7 117.75,27.85 108.95,36.65 108.95,37.76
$1N47560: length 9.8
  Bottom Layer w0.254: U4.4 111.57,24.04 109.8,25.82 108.95,25.82
$1N47561: length 10.6
  Bottom Layer w0.254: U4.2 113.48,21.5 109.8,17.82 108.95,17.82
$1N47562: length 11.7
  Bottom Layer w0.254: 108.95,13.88 109.8,13.88 116.15,20.23 U4.1
$1N47563: length 12.1
  Bottom Layer w0.254: U4.6 117.04,26.58 109.8,33.82 108.95,33.82
$1N47564: length 9.5
  Bottom Layer w0.254: U4.3 110.81,22.77 109.8,21.76 108.95,21.76
$1N47565: length 11
  Bottom Layer w0.254: 108.95,29.88 109.8,29.88 114.37,25.31 U4.5
$1N47566: length 19.4
  Bottom Layer w0.254: U4.15 121.48,21.5 109.8,9.82 108.95,9.82
$1N47567: length 41.7
  Top Layer w0.254: D4.7 119.72,41.02 121.56,41.02 122.33,40.25 122.33,25.51 v2(116.44,19.62)
  Bottom Layer w0.254: R32.1 106.95,10.79 107.6,10.79 v2(116.44,19.62)
$1N47568: length 34.4
  Top Layer w0.254: 121.16,39.92 121.78,39.29 121.78,26.09 116.04,20.34 v2(113.59,20.34)
  Bottom Layer w0.254: v2(113.59,20.34) 107.8,14.55 107.8,13.88 R31.1
$1N47569: length 14.1
  Top Layer w0.254: v2(105.9,30.32) 105.9,32.28 113.54,39.92
  Bottom Layer w0.254: R27.1 106.1,29.88 105.9,30.08 v2(105.9,30.32)
$1N47570: length 8.7
  Bottom Layer w0.254: D4.10 109.4,39.92 108.1,38.62 108.1,36.34 106.95,35.19 R26.1
$1N47571: length 11.5
  Bottom Layer w0.254: R25.1 106.95,38.73 109.21,40.98 115.01,40.98 D4.8
$1N47572: length 23.6
  Bottom Layer w0.254: D4.4 115.35,8.77 106.31,8.77 106.1,8.97 106.1,17.82 106.1,17.82 R30.1
$1N47573: length 25.8
  Bottom Layer w0.254: R29.1 106.1,21.76 105.66,21.31 105.66,8.7 106.72,7.64 113.94,7.64 D4.3
$1N47575: length 23.3
  Top Layer w0.254: v2(108.45,23.85) 113.54,18.77 113.54,5.5
  Bottom Layer w0.254: v2(108.45,23.85) 107.45,24.85 106.95,24.85 R28.1
$1N47985: length 33.7
  Bottom Layer w0.254: U3.14 92.16,22.77 91.53,23.41 80.86,23.41 79.27,24.99 79.27,26.65 77.49,28.44 65.27,28.44 U2.9
$1N48013: length 36.7
  Bottom Layer w0.254: U4.14 123.87,22.77 124.91,23.81 124.91,25.44 124.45,25.9 116.09,25.9 111.09,30.91 96.47,30.91 U3.9
$1N52982: length 6.8
  Bottom Layer w0.254: 61.1,33.06 61.1,31.1 64.35,27.85 U2.10
$1N53020: length 6.8
  Bottom Layer w0.254: 120.03,33.06 120.03,30.99 123.17,27.85 U4.10
$1N56731: length 195
  Top Layer w0.254: 78.74,1.18 78.49,1.44 78.49,2.96 77.34,4.1 60.35,4.1 59.18,5.27 59.18,5.91 55.88,9.22 42.45,9.22 v2(37.17,14.49)
  Bottom Layer w0.254: U1.16 35.88,16.69 35.49,16.29 35.49,15.72 ; 78.74,1.67 89.76,1.67 93.12,5.03 93.12,8.07 87.93,13.26 87.93,16.2 88.01,16.28 89.63,16.28 89.7,16.21 89.7,15.76 ; 78.74,1.67 78.74,1.18 ; 78.74,1.67 78.74,2.36 74.42,6.69 74.42,24.17 73.19,24.17 71.72,25.64 69.55,25.64 69.31,25.4 69.31,24.66 64.87,20.23 U2.16 64.58,16.69 64.19,16.29 C3.1 61.04,15.15 60.53,15.66 59.86,15.66 ; 35.49,15.72 31.98,15.72 31.96,15.7 31.28,15.7 ; 35.49,15.72 C1.1 36.51,15.15 v2(37.17,14.49) ; 119.04,15.66 119.71,15.66 120.22,15.15 122.99,15.15 ; C7.1 122.99,15.15 ; 122.99,15.15 123.51,15.67 U4.16 123.8,20.23 124.83,21.27 124.83,21.69 124.39,22.14 112.49,22.14 111.14,20.79 108.18,20.79 108.1,20.86 108.1,22.28 107.65,22.73 98.01,22.73 95.51,20.23 U3.16 94.68,15.16 94.55,15.02 C5.1 93.02,15.02 92.28,15.76 89.7,15.76 ; 89.7,15.76 89.7,15.66
$1N57025: length 6.1
  Bottom Layer w0.254: 93.2,33.06 93.2,28.93 94.29,27.85 U3.10

## Copper pours and planes (outline as drawn; the poured copper is in the pictures)
GND on Top Layer: 0.25,43.47 144.78,43.47 144.78,0.17 0.25,0.17
GND on Bottom Layer: 0.13,43.35 144.91,43.35 144.91,0.29 0.13,0.29

Small or netless copper shapes (teardrops, artwork), in the pictures only: 1 on Top Layer

## Text on the board
Bottom Silkscreen Layer: Clock | OE | Data | Latch | Gnd | 5V | V1.2 FSJ12101ca | BKL DDB-7S1204
